# Altium schematic sheet USBCONN_A_short_noTVS.SchDoc
size A3; SheetNumber: 16; SheetTotal: 22
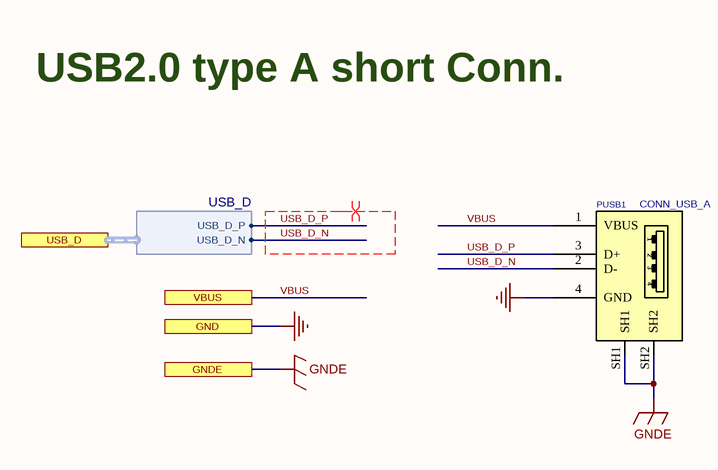
[diagram p0: USBCONN_A_short_noTVS.SchDoc]

## Parts
PUSB1  CONN_USB_A  [USB_A_REC_RA_THD_S]

## Ports
GND, GNDE, USB_D (harness USB_D), VBUS

## Harnesses
USB_D: USB_D_P, USB_D_N

## Nets
GND: PUSB1.4(GND) ; port GND
GNDE: PUSB1.SH1 PUSB1.SH2 ; port GNDE
USB_D_N: PUSB1.2(D-) ; port USB_D.USB_D_N
USB_D_P: PUSB1.3(D+) ; port USB_D.USB_D_P
VBUS: PUSB1.1(VBUS) ; port VBUS

## Layout directives
differential pair: USB_D_N, USB_D_P

## Notes on the sheet
- USB2.0 type A short Conn.

## Library data of the parts
PUSB1 = CONN_USB_A_REC_RA_THD_SHORT: CONN, USB, A, RECEPTACLE, R/A, THD; MANF_P#: USB1125; VALUE: CONN_USB_A